# Altium project LINTERNA.PrjPcb
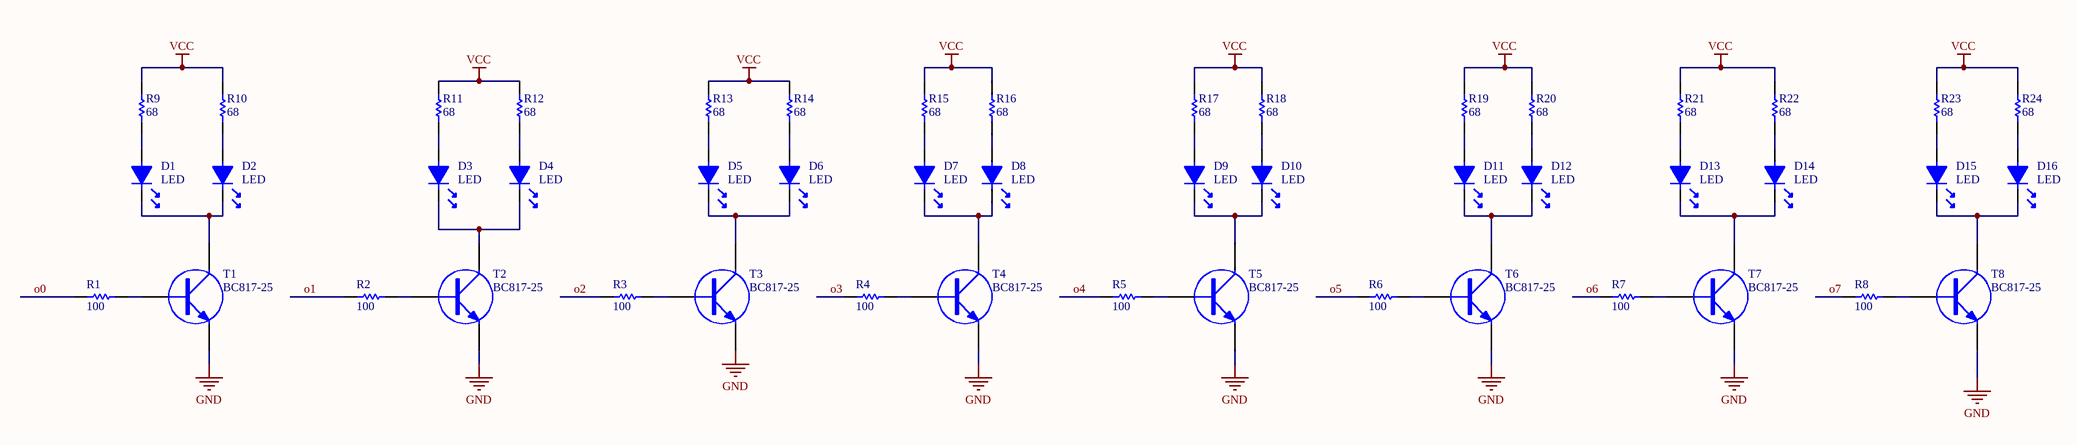
[diagram p0: Sheet1.SchDoc]
1 sheet, 48 parts. Net scope: global (net labels, ports and power ports of the same name join across sheets).
Board file: PCB1.PcbDoc

## Sheet Sheet1.SchDoc
size A3

### Parts
D1  LED  [*LED_OF-SMD2835Y]
D2  LED  [*LED_OF-SMD2835Y]
D3  LED  [*LED_OF-SMD2835Y]
D4  LED  [*LED_OF-SMD2835Y]
D5  LED  [*LED_OF-SMD2835Y]
D6  LED  [*LED_OF-SMD2835Y]
D7  LED  [*LED_OF-SMD2835Y]
D8  LED  [*LED_OF-SMD2835Y]
D9  LED  [*LED_OF-SMD2835Y]
D10  LED  [*LED_OF-SMD2835Y]
D11  LED  [*LED_OF-SMD2835Y]
D12  LED  [*LED_OF-SMD2835Y]
D13  LED  [*LED_OF-SMD2835Y]
D14  LED  [*LED_OF-SMD2835Y]
D15  LED  [*LED_OF-SMD2835Y]
D16  LED  [*LED_OF-SMD2835Y]
R1  100  [0805]
R2  100  [0805]
R3  100  [0805]
R4  100  [0805]
R5  100  [0805]
R6  100  [0805]
R7  100  [0805]
R8  100  [0805]
R9  68  [0805]
R10  68  [0805]
R11  68  [0805]
R12  68  [0805]
R13  68  [0805]
R14  68  [0805]
R15  68  [0805]
R16  68  [0805]
R17  68  [0805]
R18  68  [0805]
R19  68  [0805]
R20  68  [0805]
R21  68  [0805]
R22  68  [0805]
R23  68  [0805]
R24  68  [0805]
T1  BC817-25  [SOT23]
T2  BC817-25  [SOT23]
T3  BC817-25  [SOT23]
T4  BC817-25  [SOT23]
T5  BC817-25  [SOT23]
T6  BC817-25  [SOT23]
T7  BC817-25  [SOT23]
T8  BC817-25  [SOT23]

### Nets
GND: T1.3(E) T2.3(E) T3.3(E) T4.3(E) T5.3(E) T6.3(E) T7.3(E) T8.3(E)
VCC: R9.2 R10.2 R11.2 R12.2 R13.2 R14.2 R15.2 R16.2 R17.2 R18.2 R19.2 R20.2 R21.2 R22.2 R23.2 R24.2
o0: R1.1
o1: R2.1
o2: R3.1
o3: R4.1
o4: R5.1
o5: R6.1
o6: R7.1
o7: R8.1
NetD1_1: D1.1 R9.1
NetD1_2: D1.2 D2.2 T1.2(C)
NetD2_1: D2.1 R10.1
NetD3_1: D3.1 R11.1
NetD3_2: D3.2 D4.2 T2.2(C)
NetD4_1: D4.1 R12.1
NetD5_1: D5.1 R13.1
NetD5_2: D5.2 D6.2 T3.2(C)
NetD6_1: D6.1 R14.1
NetD7_1: D7.1 R15.1
NetD7_2: D7.2 D8.2 T4.2(C)
NetD8_1: D8.1 R16.1
NetD9_1: D9.1 R17.1
NetD9_2: D9.2 D10.2 T5.2(C)
NetD10_1: D10.1 R18.1
NetD11_1: D11.1 R19.1
NetD11_2: D11.2 D12.2 T6.2(C)
NetD12_1: D12.1 R20.1
NetD13_1: D13.1 R21.1
NetD13_2: D13.2 D14.2 T7.2(C)
NetD14_1: D14.1 R22.1
NetD15_1: D15.1 R23.1
NetD15_2: D15.2 D16.2 T8.2(C)
NetD16_1: D16.1 R24.1
NetR1_2: R1.2 T1.1(B)
NetR2_2: R2.2 T2.1(B)
NetR3_2: R3.2 T3.1(B)
NetR4_2: R4.2 T4.1(B)
NetR5_2: R5.2 T5.1(B)
NetR6_2: R6.2 T6.1(B)
NetR7_2: R7.2 T7.1(B)
NetR8_2: R8.2 T8.1(B)

### Library data of the parts
R1-R24 = RES
T1-T8 = TRANSISTOR NPN